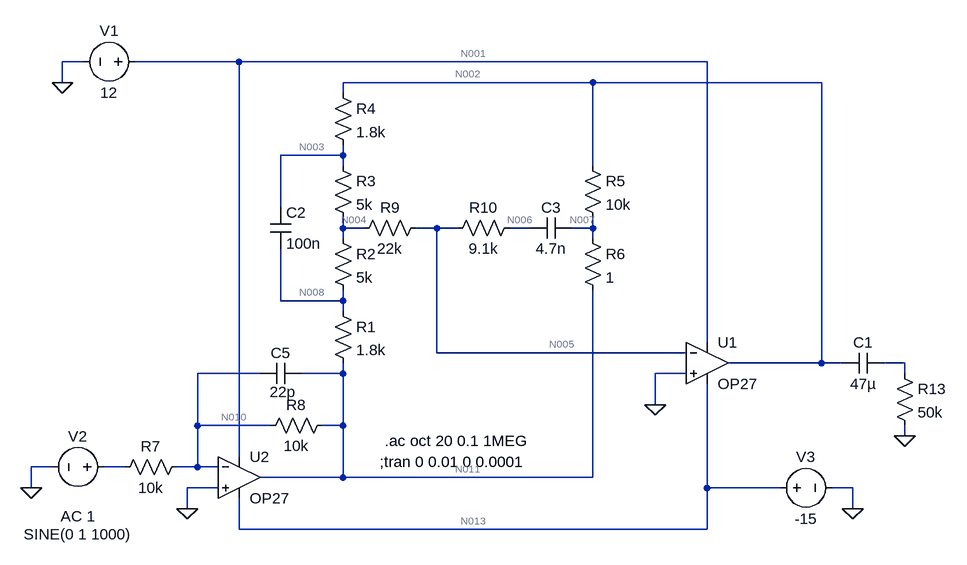
[diagram p0: schematic DSelf_Baxandallasc.asc]
DSelf_Baxandallasc.asc, the LTspice schematic file:
Version 4
SHEET 1 880 680
WIRE -560 -160 -592 -160
WIRE -320 -160 -480 -160
WIRE 400 -160 -320 -160
WIRE -592 -128 -592 -160
WIRE 224 -128 -160 -128
WIRE 576 -128 224 -128
WIRE -160 -112 -160 -128
WIRE -160 -16 -160 -32
WIRE -160 -16 -256 -16
WIRE -160 0 -160 -16
WIRE 224 0 224 -128
WIRE -256 64 -256 -16
WIRE -160 96 -160 80
WIRE -128 96 -160 96
WIRE -16 96 -48 96
WIRE 16 96 -16 96
WIRE 128 96 96 96
WIRE 224 96 224 80
WIRE 224 96 192 96
WIRE -160 112 -160 96
WIRE 224 112 224 96
WIRE -256 208 -256 128
WIRE -160 208 -160 192
WIRE -160 208 -256 208
WIRE -160 224 -160 208
WIRE 400 272 400 -160
WIRE -16 288 -16 96
WIRE 368 288 -16 288
WIRE 576 304 576 -128
WIRE 576 304 432 304
WIRE 608 304 576 304
WIRE 704 304 672 304
WIRE -288 320 -384 320
WIRE -160 320 -160 304
WIRE -160 320 -224 320
WIRE 368 320 320 320
WIRE 704 320 704 304
WIRE 320 368 320 320
WIRE -384 400 -384 320
WIRE -272 400 -384 400
WIRE -160 400 -160 320
WIRE -160 400 -192 400
WIRE 704 416 704 400
WIRE -320 448 -320 -160
WIRE -608 464 -640 464
WIRE -496 464 -528 464
WIRE -384 464 -384 400
WIRE -384 464 -416 464
WIRE -352 464 -384 464
WIRE -160 480 -160 400
WIRE -160 480 -288 480
WIRE 224 480 224 192
WIRE 224 480 -160 480
WIRE -640 496 -640 464
WIRE -352 496 -400 496
WIRE 400 496 400 336
WIRE 512 496 400 496
WIRE 624 496 592 496
WIRE -400 528 -400 496
WIRE 624 528 624 496
WIRE -320 560 -320 512
WIRE 400 560 400 496
WIRE 400 560 -320 560
FLAG -592 -128 0
FLAG -640 496 0
FLAG 320 368 0
FLAG 704 416 0
FLAG -400 528 0
FLAG 624 528 0
SYMBOL voltage -464 -160 R90
WINDOW 0 -32 56 VBottom 2
WINDOW 3 32 56 VTop 2
WINDOW 123 0 0 Left 2
WINDOW 39 0 0 Left 2
SYMATTR InstName V1
SYMATTR Value 12
SYMBOL voltage -512 464 R90
WINDOW 0 -32 56 VBottom 2
WINDOW 3 88 56 VTop 2
WINDOW 123 60 56 VTop 2
WINDOW 39 0 0 Left 2
SYMATTR InstName V2
SYMATTR Value SINE(0 1 1000)
SYMATTR Value2 AC 1
SYMBOL res -176 208 R0
SYMATTR InstName R1
SYMATTR Value 1.8k
SYMBOL res -176 96 R0
SYMATTR InstName R2
SYMATTR Value 5k
SYMBOL res -176 -16 R0
SYMATTR InstName R3
SYMATTR Value 5k
SYMBOL res -176 -128 R0
SYMATTR InstName R4
SYMATTR Value 1.8k
SYMBOL cap -272 64 R0
SYMATTR InstName C2
SYMATTR Value 100n
SYMBOL res 208 -16 R0
SYMATTR InstName R5
SYMATTR Value 10k
SYMBOL res 208 96 R0
SYMATTR InstName R6
SYMATTR Value 1
SYMBOL res -32 80 R90
WINDOW 0 0 56 VBottom 2
WINDOW 3 32 56 VTop 2
SYMATTR InstName R9
SYMATTR Value 22k
SYMBOL res 112 80 R90
WINDOW 0 0 56 VBottom 2
WINDOW 3 32 56 VTop 2
SYMATTR InstName R10
SYMATTR Value 9.1k
SYMBOL res 688 304 R0
SYMATTR InstName R13
SYMATTR Value 50k
SYMBOL cap 672 288 R90
WINDOW 0 0 32 VBottom 2
WINDOW 3 32 32 VTop 2
SYMATTR InstName C1
SYMATTR Value 47µ
SYMBOL cap 192 80 R90
WINDOW 0 0 32 VBottom 2
WINDOW 3 32 32 VTop 2
SYMATTR InstName C3
SYMATTR Value 4.7n
SYMBOL Opamps\\OP27 400 240 R0
SYMATTR InstName U1
SYMBOL Opamps\\OP27 -320 416 R0
SYMATTR InstName U2
SYMBOL res -400 448 R90
WINDOW 0 0 56 VBottom 2
WINDOW 3 32 56 VTop 2
SYMATTR InstName R7
SYMATTR Value 10k
SYMBOL res -176 384 R90
WINDOW 0 0 56 VBottom 2
WINDOW 3 32 56 VTop 2
SYMATTR InstName R8
SYMATTR Value 10k
SYMBOL voltage 496 496 R270
WINDOW 0 32 56 VTop 2
WINDOW 3 -32 56 VBottom 2
WINDOW 123 0 0 Left 2
WINDOW 39 0 0 Left 2
SYMATTR InstName V3
SYMATTR Value -15
SYMBOL cap -224 304 R90
WINDOW 0 0 32 VBottom 2
WINDOW 3 29 29 VTop 2
SYMATTR InstName C5
SYMATTR Value 22p
TEXT -96 424 Left 2 !.ac oct 20 0.1 1MEG
TEXT -104 456 Left 2 !;tran 0 0.01 0 0.0001

The netlist it stands for:
* DSelf_Baxandallasc.asc
V1 N001 0 12
V2 N012 0 SINE(0 1 1000) AC 1
R1 N008 N011 1.8k
R2 N004 N008 5k
R3 N003 N004 5k
R4 N002 N003 1.8k
C2 N003 N008 100n
R5 N002 N007 10k
R6 N007 N011 1
R9 N005 N004 22k
R10 N006 N005 9.1k
R13 N009 0 50k
C1 N009 N002 47µ
C3 N007 N006 4.7n
XU1 0 N005 N001 N013 N002 OP27  ; pins In+ In- V+ V- OUT
XU2 0 N010 N001 N013 N011 OP27  ; pins In+ In- V+ V- OUT
R7 N010 N012 10k
R8 N011 N010 10k
V3 N013 0 -15
C5 N011 N010 22p
.ac oct 20 0.1 1MEG
;tran 0 0.01 0 0.0001
.lib ADI.lib
.backanno
.end

* Results of the author's LTspice run, read from the files saved beside the schematic
* Operating Point, zero values left out:
*   V(n001) = 12 V
*   V(n008) = 1.77 µV
*   V(n011) = 1.299 µV
*   V(n004) = 3.078 µV
*   V(n003) = 5.101 µV
*   V(n002) = 5.829 µV
*   V(n007) = 1.3 µV
*   V(n005) = -64.71 nV
*   V(n006) = -64.71 nV
*   V(n013) = -15 V
*   V(n010) = -64.71 nV
*   I(R8) = 136.4 pA
*   I(R7) = -6.471 pA
*   I(R9) = -142.9 pA
*   I(R6) = 452.9 pA
*   I(R5) = 452.9 pA
*   I(R4) = 404.5 pA
*   I(R3) = 404.5 pA
*   I(R2) = 261.6 pA
*   I(R1) = 261.6 pA
*   I(V3) = 5.332 mA
*   I(V2) = -6.471 pA
*   I(V1) = -5.332 mA
*   Ix(u1:1) = 142.9 pA
*   Ix(u1:2) = 142.9 pA
*   Ix(u1:3) = 2.666 mA
*   Ix(u1:4) = -2.666 mA
*   Ix(u1:5) = -860.4 pA
*   Ix(u2:1) = 142.9 pA
*   Ix(u2:2) = 142.9 pA
*   Ix(u2:3) = 2.666 mA
*   Ix(u2:4) = -2.666 mA
*   Ix(u2:5) = 575.1 pA
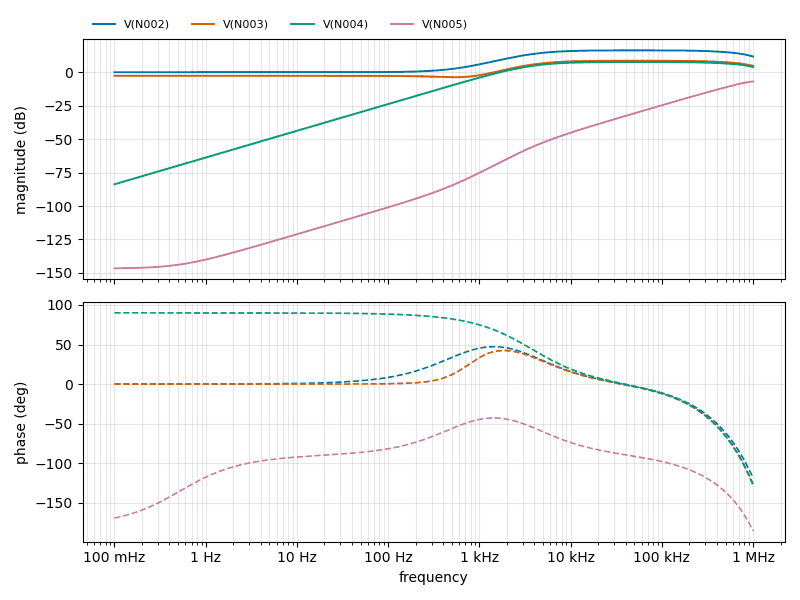
[diagram p1: AC Analysis of DSelf_Baxandallasc.asc, plotted from the saved traces]
* AC Analysis, 1 run:
*   V(N002): -0.00 dB at 100 mHz, 11.72 dB at 1 MHz, peak 16.34 dB at 54.28 kHz, 3 dB below the peak at 3.606 kHz and 797.2 kHz
*   V(N003): -2.67 dB at 100 mHz, 4.70 dB at 1 MHz, peak 8.57 dB at 56.19 kHz, 3 dB below the peak at 3.71 kHz and 877.5 kHz
*   V(N004): -83.75 dB at 100 mHz, 3.89 dB at 1 MHz, peak 7.64 dB at 56.19 kHz, 3 dB below the peak at 3.695 kHz and 894.6 kHz
*   V(N005): -146.55 dB at 100 mHz, -6.90 dB at 1 MHz, peak -6.90 dB at 1 MHz, 3 dB below the peak at 598.3 kHz